# Altium project TestProj_DDR3.PrjPcb
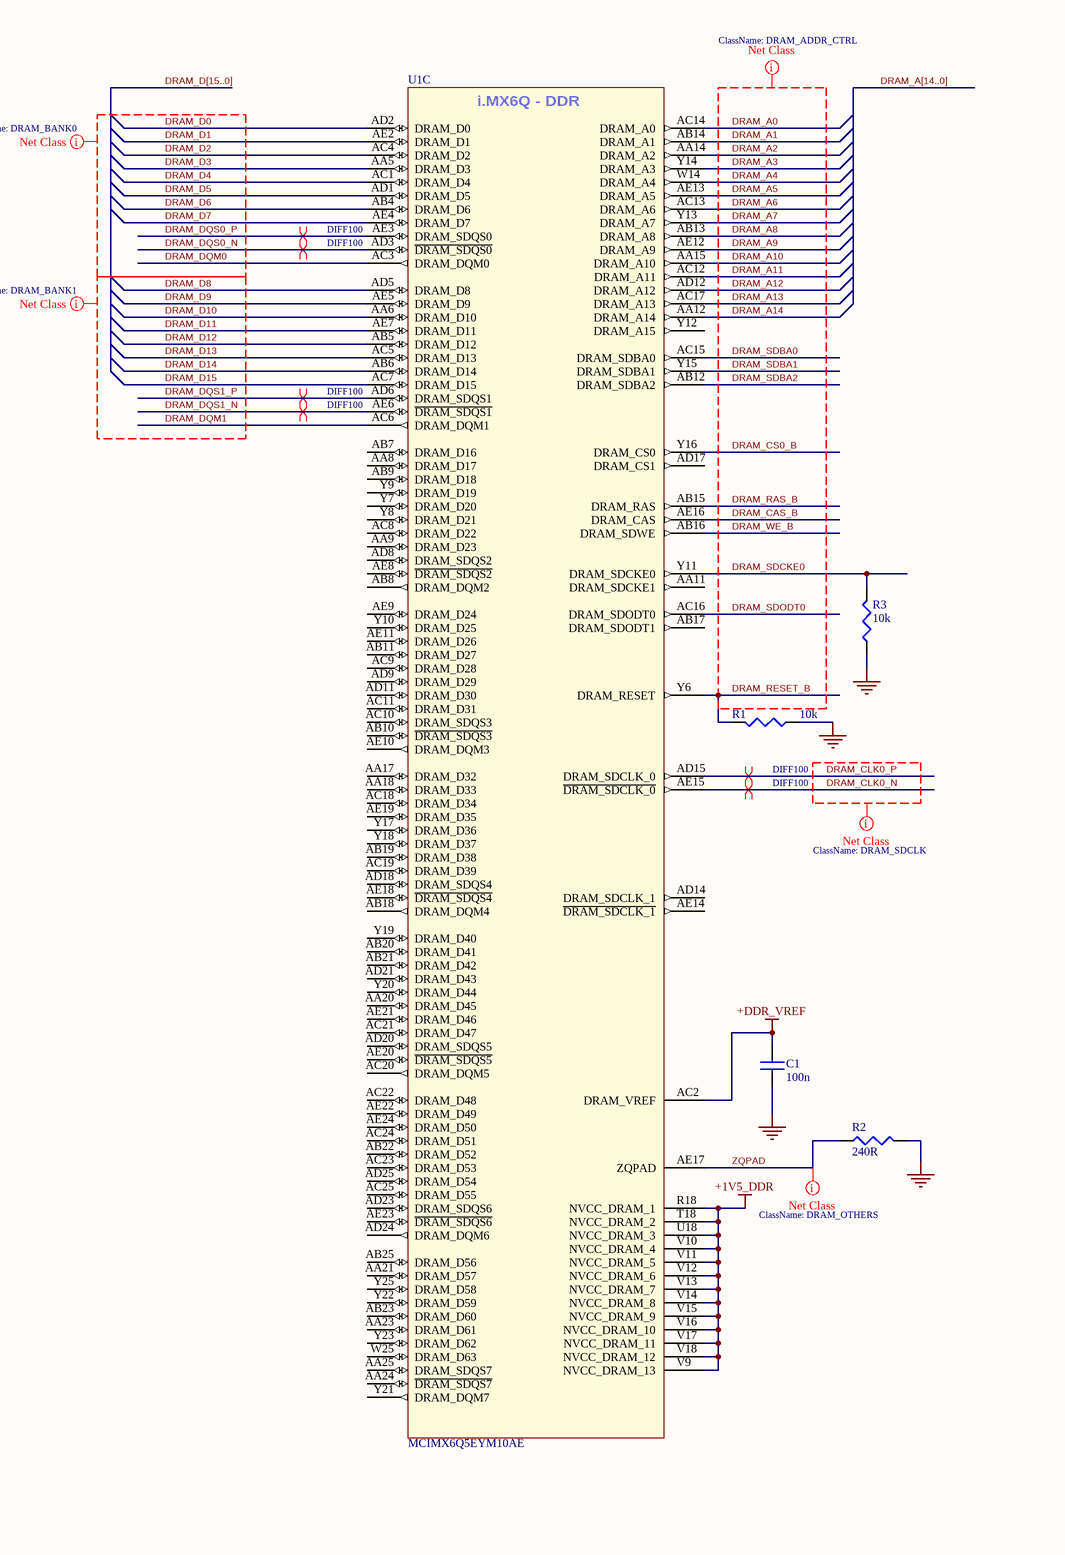
[diagram p0: iMX6q_DDR3.SchDoc, left]
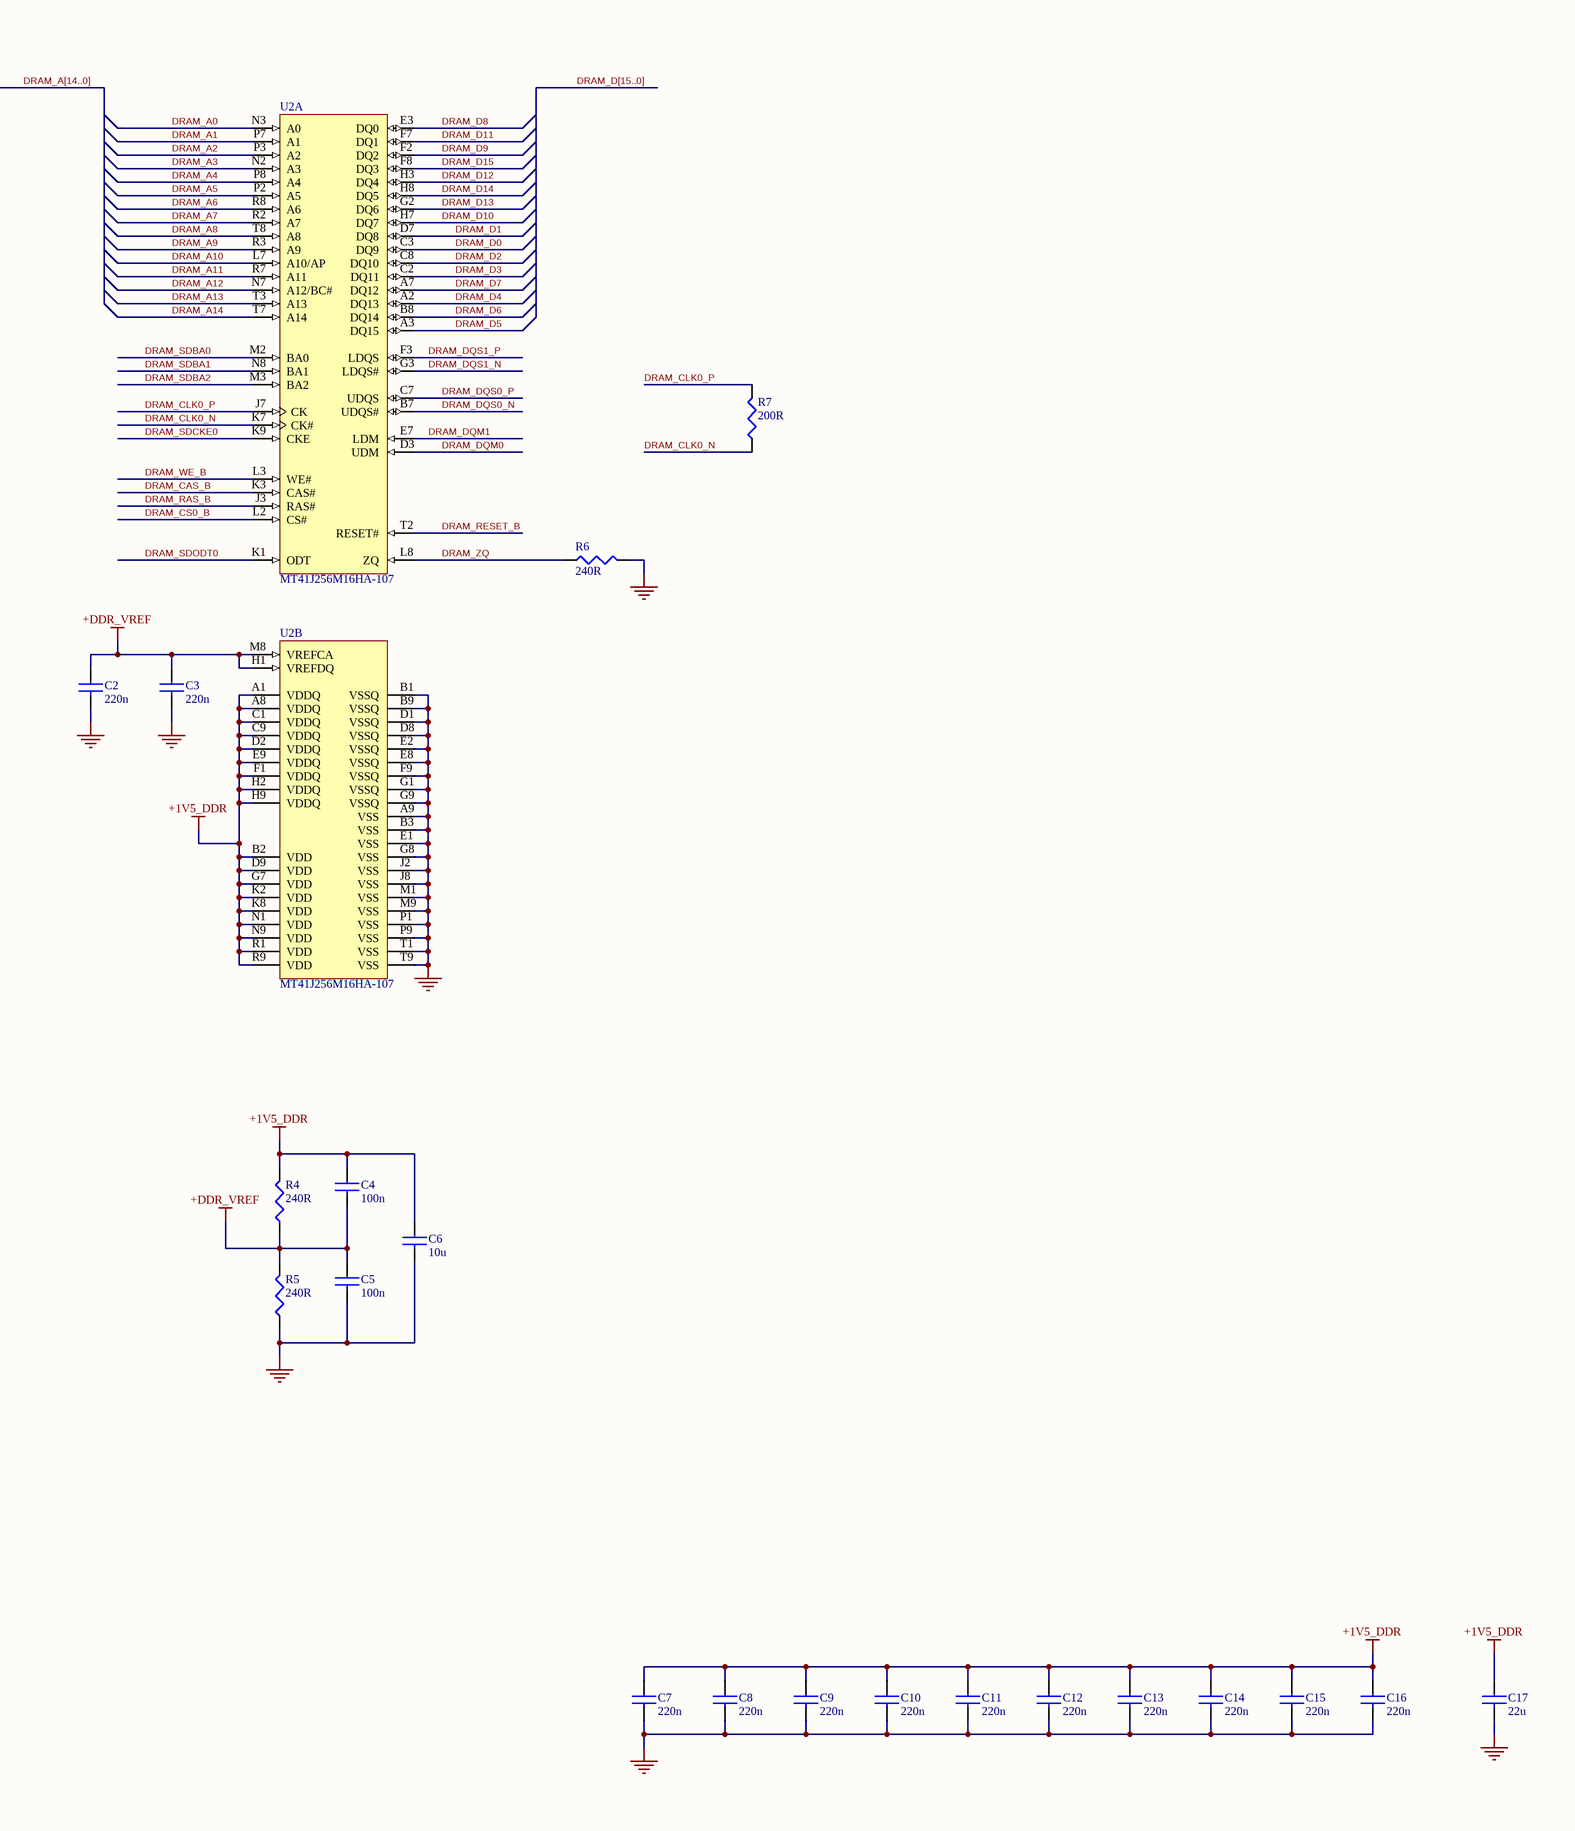
[diagram p1: iMX6q_DDR3.SchDoc, right]
1 sheet, 26 parts. Net scope: global (net labels, ports and power ports of the same name join across sheets).
Board file: TestProj_DDR3.PcbDoc

## Sheet iMX6q_DDR3.SchDoc: Test Project
size A2; SheetNumber: {}; SheetTotal: {}; PageSetup: Record=PageOptions|CenterHorizontal=False|CenterVertical=False|PrintScale=0.95|XCorrection=0.00|YCorrection=0.00|PrintKind=1|BorderSize=5000000|LeftOffset=0|BottomOffset=0|Orientation=1|PaperLength=1000|PaperWidth=1000|Scale=100|PaperSource=15|PrintQuality=600|MediaType=1|DitherType=10|PaperKind=A4|PrintScaleMode=1; IzmNo: {*}; IzmPage: {Зам.}; Scale: 1:1; ProcessInspection: {Т.контр.}; Mass: {Масса}; NormInspection: {Н.контр.}; EngineerName: {Инженер}; Letter1Column: {}; Letter2Column: {}; Letter3Column: {}; DocumentType: {Документ}; DocumentType1str: {Документ}; DocumentType2str: {Документ}; Rule: PcbType=ProtelPcb

### Parts
C1  100n  [C0402]
C2  220n  [C0402]
C3  220n  [C0402]
C4  100n  [C0402]
C5  100n  [C0402]
C6  10u  [C0603]
C7  220n  [C0402]
C8  220n  [C0402]
C9  220n  [C0402]
C10  220n  [C0402]
C11  220n  [C0402]
C12  220n  [C0402]
C13  220n  [C0402]
C14  220n  [C0402]
C15  220n  [C0402]
C16  220n  [C0402]
C17  22u  [C0603]
R1  10k  [R0402]
R2  240R  [R0402]
R3  10k  [R0402]
R4  240R  [R0402]
R5  240R  [R0402]
R6  240R  [R0402]
R7  200R  [R0402]
U1  MCIMX6Q5EYM10AE  [PBGA624]  (part C of 15)
U2  MT41J256M16HA-107  [MICT-HA-96]  (parts A,B of 3)

### Nets
+1V5_DDR: C4.1 C6.1 C7.1 C8.1 C9.1 C10.1 C11.1 C12.1 C13.1 C14.1 C15.1 C16.1 C17.1 R4.2 U1.R18(NVCC_DRAM_1) U1.T18(NVCC_DRAM_2) U1.U18(NVCC_DRAM_3) U1.V9(NVCC_DRAM_13) U1.V10(NVCC_DRAM_4) U1.V11(NVCC_DRAM_5) U1.V12(NVCC_DRAM_6) U1.V13(NVCC_DRAM_7) U1.V14(NVCC_DRAM_8) U1.V15(NVCC_DRAM_9) U1.V16(NVCC_DRAM_10) U1.V17(NVCC_DRAM_11) U1.V18(NVCC_DRAM_12) U2.A1(VDDQ) U2.A8(VDDQ) U2.B2(VDD) U2.C1(VDDQ) U2.C9(VDDQ) U2.D2(VDDQ) U2.D9(VDD) U2.E9(VDDQ) U2.F1(VDDQ) U2.G7(VDD) U2.H2(VDDQ) U2.H9(VDDQ) U2.K2(VDD) U2.K8(VDD) U2.N1(VDD) U2.N9(VDD) U2.R1(VDD) U2.R9(VDD)
+DDR_VREF: C1.1 C2.1 C3.1 C4.2 C5.1 R4.1 R5.2 U1.AC2(DRAM_VREF) U2.H1(VREFDQ) U2.M8(VREFCA)
GND: C1.2 C2.2 C3.2 C5.2 C6.2 C7.2 C8.2 C9.2 C10.2 C11.2 C12.2 C13.2 C14.2 C15.2 C16.2 C17.2 R1.1 R2.2 R3.1 R5.1 R6.1 U2.A9(VSS) U2.B1(VSSQ) U2.B3(VSS) U2.B9(VSSQ) U2.D1(VSSQ) U2.D8(VSSQ) U2.E1(VSS) U2.E2(VSSQ) U2.E8(VSSQ) U2.F9(VSSQ) U2.G1(VSSQ) U2.G8(VSS) U2.G9(VSSQ) U2.J2(VSS) U2.J8(VSS) U2.M1(VSS) U2.M9(VSS) U2.P1(VSS) U2.P9(VSS) U2.T1(VSS) U2.T9(VSS)
DRAM_A0: U1.AC14(DRAM_A0) U2.N3(A0)
DRAM_A1: U1.AB14(DRAM_A1) U2.P7(A1)
DRAM_A2: U1.AA14(DRAM_A2) U2.P3(A2)
DRAM_A3: U1.Y14(DRAM_A3) U2.N2(A3)
DRAM_A4: U1.W14(DRAM_A4) U2.P8(A4)
DRAM_A5: U1.AE13(DRAM_A5) U2.P2(A5)
DRAM_A6: U1.AC13(DRAM_A6) U2.R8(A6)
DRAM_A7: U1.Y13(DRAM_A7) U2.R2(A7)
DRAM_A8: U1.AB13(DRAM_A8) U2.T8(A8)
DRAM_A9: U1.AE12(DRAM_A9) U2.R3(A9)
DRAM_A10: U1.AA15(DRAM_A10) U2.L7(A10/AP)
DRAM_A11: U1.AC12(DRAM_A11) U2.R7(A11)
DRAM_A12: U1.AD12(DRAM_A12) U2.N7(A12/BC#)
DRAM_A13: U1.AC17(DRAM_A13) U2.T3(A13)
DRAM_A14: U1.AA12(DRAM_A14) U2.T7(A14)
DRAM_CAS_B: U1.AE16(DRAM_CAS) U2.K3(CAS#)
DRAM_CLK0_N: R7.1 U1.AE15(~{DRAM_SDCLK_0}) U2.K7(CK#)
DRAM_CLK0_P: R7.2 U1.AD15(DRAM_SDCLK_0) U2.J7(CK)
DRAM_CS0_B: U1.Y16(DRAM_CS0) U2.L2(CS#)
DRAM_D0: U1.AD2(DRAM_D0) U2.C3(DQ9)
DRAM_D1: U1.AE2(DRAM_D1) U2.D7(DQ8)
DRAM_D2: U1.AC4(DRAM_D2) U2.C8(DQ10)
DRAM_D3: U1.AA5(DRAM_D3) U2.C2(DQ11)
DRAM_D4: U1.AC1(DRAM_D4) U2.A2(DQ13)
DRAM_D5: U1.AD1(DRAM_D5) U2.A3(DQ15)
DRAM_D6: U1.AB4(DRAM_D6) U2.B8(DQ14)
DRAM_D7: U1.AE4(DRAM_D7) U2.A7(DQ12)
DRAM_D8: U1.AD5(DRAM_D8) U2.E3(DQ0)
DRAM_D9: U1.AE5(DRAM_D9) U2.F2(DQ2)
DRAM_D10: U1.AA6(DRAM_D10) U2.H7(DQ7)
DRAM_D11: U1.AE7(DRAM_D11) U2.F7(DQ1)
DRAM_D12: U1.AB5(DRAM_D12) U2.H3(DQ4)
DRAM_D13: U1.AC5(DRAM_D13) U2.G2(DQ6)
DRAM_D14: U1.AB6(DRAM_D14) U2.H8(DQ5)
DRAM_D15: U1.AC7(DRAM_D15) U2.F8(DQ3)
DRAM_DQM0: U1.AC3(DRAM_DQM0) U2.D3(UDM)
DRAM_DQM1: U1.AC6(DRAM_DQM1) U2.E7(LDM)
DRAM_DQS0_N: U1.AD3(~{DRAM_SDQS0}) U2.B7(UDQS#)
DRAM_DQS0_P: U1.AE3(DRAM_SDQS0) U2.C7(UDQS)
DRAM_DQS1_N: U1.AE6(~{DRAM_SDQS1}) U2.G3(LDQS#)
DRAM_DQS1_P: U1.AD6(DRAM_SDQS1) U2.F3(LDQS)
DRAM_RAS_B: U1.AB15(DRAM_RAS) U2.J3(RAS#)
DRAM_RESET_B: R1.2 U1.Y6(DRAM_RESET) U2.T2(RESET#)
DRAM_SDBA0: U1.AC15(DRAM_SDBA0) U2.M2(BA0)
DRAM_SDBA1: U1.Y15(DRAM_SDBA1) U2.N8(BA1)
DRAM_SDBA2: U1.AB12(DRAM_SDBA2) U2.M3(BA2)
DRAM_SDCKE0: R3.2 U1.Y11(DRAM_SDCKE0) U2.K9(CKE)
DRAM_SDODT0: U1.AC16(DRAM_SDODT0) U2.K1(ODT)
DRAM_WE_B: U1.AB16(DRAM_SDWE) U2.L3(WE#)
DRAM_ZQ: R6.2 U2.L8(ZQ)
ZQPAD: R2.1 U1.AE17(ZQPAD)

Not connected (* = marked no-connect by the designer): U1 AA8(DRAM_D17) AA9(DRAM_D23) AA11(DRAM_SDCKE1) AA17(DRAM_D32) AA18(DRAM_D33) AA20(DRAM_D45) AA21(DRAM_D57) AA23(DRAM_D61) AA24(~{DRAM_SDQS7}) AA25(DRAM_SDQS7) AB7(DRAM_D16) AB8(DRAM_DQM2) AB9(DRAM_D18) AB10(~{DRAM_SDQS3}) AB11(DRAM_D27) AB17(DRAM_SDODT1) AB18(DRAM_DQM4) AB19(DRAM_D38) AB20(DRAM_D41) AB21(DRAM_D42) AB22(DRAM_D52) AB23(DRAM_D60) AB25(DRAM_D56) AC8(DRAM_D22) AC9(DRAM_D28) AC10(DRAM_SDQS3) AC11(DRAM_D31) AC18(DRAM_D34) AC19(DRAM_D39) AC20(DRAM_DQM5) AC21(DRAM_D47) AC22(DRAM_D48) AC23(DRAM_D53) AC24(DRAM_D51) AC25(DRAM_D55) AD8(DRAM_SDQS2) AD9(DRAM_D29) AD11(DRAM_D30) AD14(DRAM_SDCLK_1) AD17(DRAM_CS1) AD18(DRAM_SDQS4) AD20(DRAM_SDQS5) AD21(DRAM_D43) AD23(DRAM_SDQS6) AD24(DRAM_DQM6) AD25(DRAM_D54) AE8(~{DRAM_SDQS2}) AE9(DRAM_D24) AE10(DRAM_DQM3) AE11(DRAM_D26) AE14(~{DRAM_SDCLK_1}) AE18(~{DRAM_SDQS4}) AE19(DRAM_D35) AE20(~{DRAM_SDQS5}) AE21(DRAM_D46) AE22(DRAM_D49) AE23(~{DRAM_SDQS6}) AE24(DRAM_D50) W25(DRAM_D63) Y7(DRAM_D20) Y8(DRAM_D21) Y9(DRAM_D19) Y10(DRAM_D25) Y12(DRAM_A15) Y17(DRAM_D36) Y18(DRAM_D37) Y19(DRAM_D40) Y20(DRAM_D44) Y21(DRAM_DQM7) Y22(DRAM_D59) Y23(DRAM_D62) Y25(DRAM_D58)

### Buses and harness runs
bus DRAM_A[14..0]
bus DRAM_D[15..0]

### Layout directives
net class DRAM_BANK0: DRAM_D0, DRAM_D1, DRAM_D2, DRAM_D3, DRAM_D4, DRAM_D5, DRAM_D6, DRAM_D7, DRAM_DQM0, DRAM_DQS0_N, DRAM_DQS0_P
net class DRAM_BANK1: DRAM_D8, DRAM_D9, DRAM_D10, DRAM_D11, DRAM_D12, DRAM_D13, DRAM_D14, DRAM_D15, DRAM_DQM1, DRAM_DQS1_N, DRAM_DQS1_P
differential pair; net class DIFF100: DRAM_CLK0_N, DRAM_CLK0_P, DRAM_DQS0_N, DRAM_DQS0_P, DRAM_DQS1_N, DRAM_DQS1_P
net class DRAM_ADDR_CTRL: DRAM_A0, DRAM_A1, DRAM_A2, DRAM_A3, DRAM_A4, DRAM_A5, DRAM_A6, DRAM_A7, DRAM_A8, DRAM_A9, DRAM_A10, DRAM_A11, DRAM_A12, DRAM_A13, DRAM_A14, DRAM_CAS_B, DRAM_CS0_B, DRAM_RAS_B, DRAM_RESET_B, DRAM_SDBA0, DRAM_SDBA1, DRAM_SDBA2, DRAM_SDCKE0, DRAM_SDODT0, DRAM_WE_B
net class DRAM_SDCLK: DRAM_CLK0_N, DRAM_CLK0_P
net class DRAM_OTHERS: ZQPAD

### Notes on the sheet
- Title
- Size:
- Date:
- File:
- A2
- Number:
- Time:
- Revision:
- Sheet
- of
- (in symbol MCIMX6Q5EYM10AC, part C) i.MX6Q - DDR

### Library data of the parts
C1 C4 C5 = C1005X5R1H104K: CAP CER .10UF 50V X5R 10% 0402; Manufacturer: TDK Corporation; Capacitance: 0.1µF; Value: 100nF; .Checked PCB: used; Category: Capacitors; Supplier Part Number: 445-5942-1-ND; Manufacturer Part Number: C1005X5R1H104K; Operating Temperature: -55°C ~ 85°C; Package / Case: 0402 (1005 Metric); Price 1k [$]: 0.02340; .Checked SCH: used; Voltage - Rated: 50V; Supplier: Digikey; Supplier 1: Digi-Key; Supplier Part Number 1: 445-5942-1-ND; RoHS: RoHS Compliant; Stock 1: 106926; Pricing 1: 1=0.27, 10=0.18, 100=0.072, 250=0.05176, 500=0.0369, 1000=0.027 (USD); Tolerance: ±10%; Temperature Coefficient: X5R; Mounting Type: Surface Mount, MLCC; Applications: General Purpose; Ratings: -; Size / Dimension: 0.039" L x 0.020" W (1.00mm x 0.50mm); Height - Seated (Max): -; Thickness (Max): 0.022" (0.55mm); Lead Spacing: -; Features: -; Packaging: Cut Tape (CT); Lead Style: -; ComponentLink1URL: http://www.tdk.co.jp/tefe02/e412_c.pdf; ComponentLink1Description: http://www.tdk.co.jp/tefe02/e412_c.pdf
C2 C3 C7-C16 = C1005X5R1E224M: CAP CER .22UF 25V X5R 20% 0402; Manufacturer: TDK Corporation; Capacitance: 0.22µF; Value: 220nF; .Checked PCB: used; Category: Capacitors; Supplier Part Number: 445-5945-1-ND; Manufacturer Part Number: C1005X5R1E224M; Operating Temperature: -55°C ~ 85°C; Package / Case: 0402 (1005 Metric); Price 1k [$]: 0.02600; .Checked SCH: used; Voltage - Rated: 25V; Supplier: Digikey; Supplier 1: Digi-Key; Supplier Part Number 1: 445-5945-1-ND; RoHS: RoHS Compliant; Stock 1: 54593; Pricing 1: 1=0.3, 10=0.2, 100=0.08, 250=0.05752, 500=0.041, 1000=0.03 (USD); Tolerance: ±20%; Temperature Coefficient: X5R; Mounting Type: Surface Mount, MLCC; Applications: General Purpose; Ratings: -; Size / Dimension: 0.039" L x 0.020" W (1.00mm x 0.50mm); Height - Seated (Max): -; Thickness (Max): 0.022" (0.55mm); Lead Spacing: -; Features: -; Packaging: Cut Tape (CT); Lead Style: -; ComponentLink1URL: http://www.tdk.co.jp/tefe02/e412_c.pdf; ComponentLink1Description: http://www.tdk.co.jp/tefe02/e412_c.pdf
C6 = C1608X5R0J106M: CAP CER 10UF 6.3V X5R 20% 0603; Manufacturer: TDK Corporation; Capacitance: 10µF; Value: 10µF; .Checked PCB: used; Category: Capacitors; Supplier Part Number: 445-4112-1-ND; Manufacturer Part Number: C1608X5R0J106M; Operating Temperature: -55°C ~ 85°C; Package / Case: 0603 (1608 Metric); Price 1k [$]: 0.08580; .Checked SCH: used; Voltage - Rated: 6.3V; Features: Low ESR; Supplier: Digikey; Supplier 1: Digi-Key; Supplier Part Number 1: 445-4112-1-ND; RoHS: RoHS Compliant; Stock 1: 48157; Pricing 1: 1=0.46, 10=0.363, 100=0.1898, 250=0.14024, 500=0.1089, 1000=0.0858 (USD); Tolerance: ±20%; Temperature Coefficient: X5R; Mounting Type: Surface Mount, MLCC; Applications: General Purpose; Ratings: -; Size / Dimension: 0.063" L x 0.031" W (1.60mm x 0.80mm); Height - Seated (Max): -; Thickness (Max): 0.037" (0.95mm); Lead Spacing: -; Packaging: Cut Tape (CT); Lead Style: -; ComponentLink1URL: http://www.tdk.com/pdf/general_B11.pdf; ComponentLink1Description: http://www.tdk.com/pdf/general_B11.pdf
C17 = GRM188R60G226MEA0L: CAP CER 22UF 4V 20% X5R 0603; Manufacturer: Murata Electronics North America; Capacitance: 22µF; .Checked PCB: RF, used by MM; .Checked SCH: MM, checked by RF; .Creator: MM; Supplier 1: Digi-Key; Supplier Part Number 1: 490-5526-1-ND; Manufacturer Part Number: GRM188R60G226MEA0L; RoHS: RoHS Compliant; Category: Capacitors; Stock 1: 5760; Pricing 1: 1=0.79, 10=0.663, 50=0.4752, 100=0.4158, 250=0.32672, 500=0.297, 1000=0.2376 (USD); Voltage - Rated: 4V; Tolerance: ±20%; Temperature Coefficient: X5R; Mounting Type: Surface Mount, MLCC; Operating Temperature: -55°C ~ 85°C; Applications: General Purpose; Ratings: -; Package / Case: 0603 (1608 Metric); Size / Dimension: 0.063" L x 0.031" W (1.60mm x 0.80mm); Height - Seated (Max): -; Thickness (Max): 0.035" (0.90mm); Lead Spacing: -; Features: -; Packaging: Cut Tape (CT); Lead Style: -; ComponentLink1URL: http://www.murata.com/products/catalog/pdf/c02e.pdf; ComponentLink1Description: http://www.murata.com/products/catalog/pdf/c02e.pdf
R1 R3 = RC0402FR-0710KL: RES 10.0K OHM 1/16W 1% 0402 SMD; Manufacturer: Yageo; Power (Watts): 0.063W, 1/16W; .Checked PCB: used; Temperature Coefficient: ±100ppm/°C; Category: Resistors; Supplier Part Number: 311-10.0KLRCT-ND; Manufacturer Part Number: RC0402FR-0710KL; Package / Case: 0402 (1005 Metric); Price 1k [$]: 0.01421; Resistance (Ohms): 10K; Tolerance: ±1%; Value: 10k; .Checked SCH: used; Supplier: Digikey; Supplier 1: Digi-Key; Supplier Part Number 1: 311-10.0KLRCT-ND; RoHS: RoHS Compliant; Stock 1: 2916495; Pricing 1: 10=0.014, 50=0.0104, 100=0.0079, 250=0.00584, 500=0.00432, 1000=0.00288 (USD); Composition: Thick Film; Features: -; Size / Dimension: 0.039" L x 0.020" W (1.00mm x 0.50mm); Height: 0.016" (0.40mm); Number of Terminations: 2; Packaging: Cut Tape (CT); ComponentLink1URL: http://www.yageo.com/documents/recent/PYu-RC0402_51_RoHS_L_6.pdf; ComponentLink1Description: http://www.yageo.com/documents/recent/PYu-RC0402_51_RoHS_L_6.pdf
R2 R4-R6 = RMCF0402FT240R: RES TF 240 OHM 1% 0.0625W 0402; Manufacturer: Stackpole Electronics Inc; Resistance (Ohms): 240; Power (Watts): 0.063W, 1/16W; .Checked PCB: used; Temperature Coefficient: ±100ppm/°C; Category: Resistors; Supplier Part Number: RMCF0402FT240RCT-ND; Manufacturer Part Number: RMCF0402FT240R; Package / Case: 0402 (1005 Metric); Price 1k [$]: 0.00384; Tolerance: ±1%; Value: 240R; .Checked SCH: used; Supplier: Digikey; Supplier 1: Digi-Key; Supplier Part Number 1: RMCF0402FT240RCT-ND; RoHS: RoHS Compliant; Stock 1: 39860; Pricing 1: 1=0.04, 10=0.025, 50=0.0138, 100=0.0105, 250=0.0078, 500=0.00576, 1000=0.00384 (USD); Composition: Thick Film; Features: -; Size / Dimension: 0.039" L x 0.020" W (1.00mm x 0.50mm); Height: 0.016" (0.40mm); Number of Terminations: 2; Packaging: Cut Tape (CT); ComponentLink1URL: http://www.seielect.com/Catalog/SEI-RMCF.pdf; ComponentLink1Description: http://www.seielect.com/Catalog/SEI-RMCF.pdf
R7 = CRCW0402200RFKED: RES 200 OHM 1/16W 1% 0402 SMD; Manufacturer: Vishay Dale; Resistance (Ohms): 200; Power (Watts): 0.063W, 1/16W; Temperature Coefficient: ±100ppm/°C; .Checked PCB: RF, used by MM; .Checked SCH: MM, checked by RF; .Creator: MM; Supplier 1: Digi-Key; Manufacturer Part Number: CRCW0402200RFKED; RoHS: RoHS Compliant; Category: Resistors; Stock 1: 251574; Pricing 1: 10=0.083, 50=0.0444, 200=0.0255, 1000=0.0174 (USD); Composition: Thick Film; Features: Automotive AEC-Q200 Qualified; Tolerance: ±1%; Package / Case: 0402 (1005 Metric); Supplier Device Package: 0402 (1005 Metric); Size / Dimension: 0.039" L x 0.020" W (1.00mm x 0.50mm); Height: 0.016" (0.40mm); Number of Terminations: 2; Packaging: Cut Tape (CT); ComponentLink1URL: http://www.vishay.com/doc?20035; ComponentLink1Description: http://www.vishay.com/doc?20035; Supplier Part Number 1: 541-200LCT-ND
U1 = MCIMX6Q5EYM10AC: IC MCU 32BIT ARM QUAD 624FCBGA; Manufacturer: Freescale Semiconductor; Core Processor: ARM® Cortex™-A9; Core Size: 32-Bit Quad-Core; Speed: 1.0GHz; Connectivity: CAN, EBI/EMI, ESAI, Ethernet, GPMI, I2C, MMC/SD, PCI, SATA, SPI, UART, USB, USB OTG; Peripherals: DMA, HDMI, I2S/SSI/AC97, MIPI CSI, MIMI DSI, MIPI HIS, PWM, WDT; Number of I /O: 224; Program Memory Type: External Program Memory; RAM Size: 256K x 8; Voltage - Supply (Vcc/Vdd): 0.925 V ~ 1.5 V; Oscillator Type: Internal; .Creator: MM; .Checked PCB: MM, checked by RF; Supplier 1: Digi-Key; Manufacturer Part Number: MCIMX6Q5EYM10AE; RoHS: RoHS Compliant; Category: Integrated Circuits (ICs); Stock 1: 0; Pricing 1: 1=54.98, 10=51.922, 25=48.868, 100=30.5424 (USD); Program Memory Size: -; EEPROM Size: -; Data Converters: -; Operating Temperature: -20°C ~ 105°C; Package / Case: 624-FBGA, FCBGA; Packaging: Tray; ComponentLink1URL: http://cache.freescale.com/files/32bit/doc/data_sheet/IMX6DQCEC.pdf; ComponentLink1Description: http://cache.freescale.com/files/32bit/doc/data_sheet/IMX6DQCEC.pdf; Supplier Part Number 1: MCIMX6Q5EYM10AC-ND; .Checked SCH: MM
U2 = MT41J256M16HA-107: 4Gb DDR3-1866 SDRAM, 256Mb x 16, 1.071ns, 1.5V, 0 to 95 degC, 96-Ball FBGA, Pb-Free; Manufacturer: Micron; CL: CL = 13; Clock Rate: 933 MHz; Op. Temp.: 0C to +95C; DatasheetVersion: Rev.J; PackageVersion: Rev.E; PackageReference: MICT-HA-96; PackageDescription: 96-Ball Fine-Pitch Ball Grid Array, 14 x 9 mm, Pitch 0.8 mm; Cycle Time: 1.071ns; Data Rate: DDR3-1866; Density: 4Gb; Depth: 256Mb; Package: FBGA; Pin Count: 96-ball; RoHS: Yes; Voltage: 1.5V; Width: x16; Mounting Technology: Surface Mount; PartNumber: MT41J256M16HA-107; ComponentLink1Description: Manufacturer URL; ComponentLink1URL: http://www.micron.com/; ComponentLink2Description: Datasheet; ComponentLink2URL: http://www.micron.com/~/media/Documents/Products/Data%20Sheet/DRAM/4Gb_DDR3_SDRAM.pdf; ComponentLink3Description: Package Specification; ComponentLink3URL: http://www.micron.com/~/media/Documents/Products/Data%20Sheet/DRAM/4Gb_1_35V_DDR3L.pdf